# Altium project PCB_Project1.PrjPCB
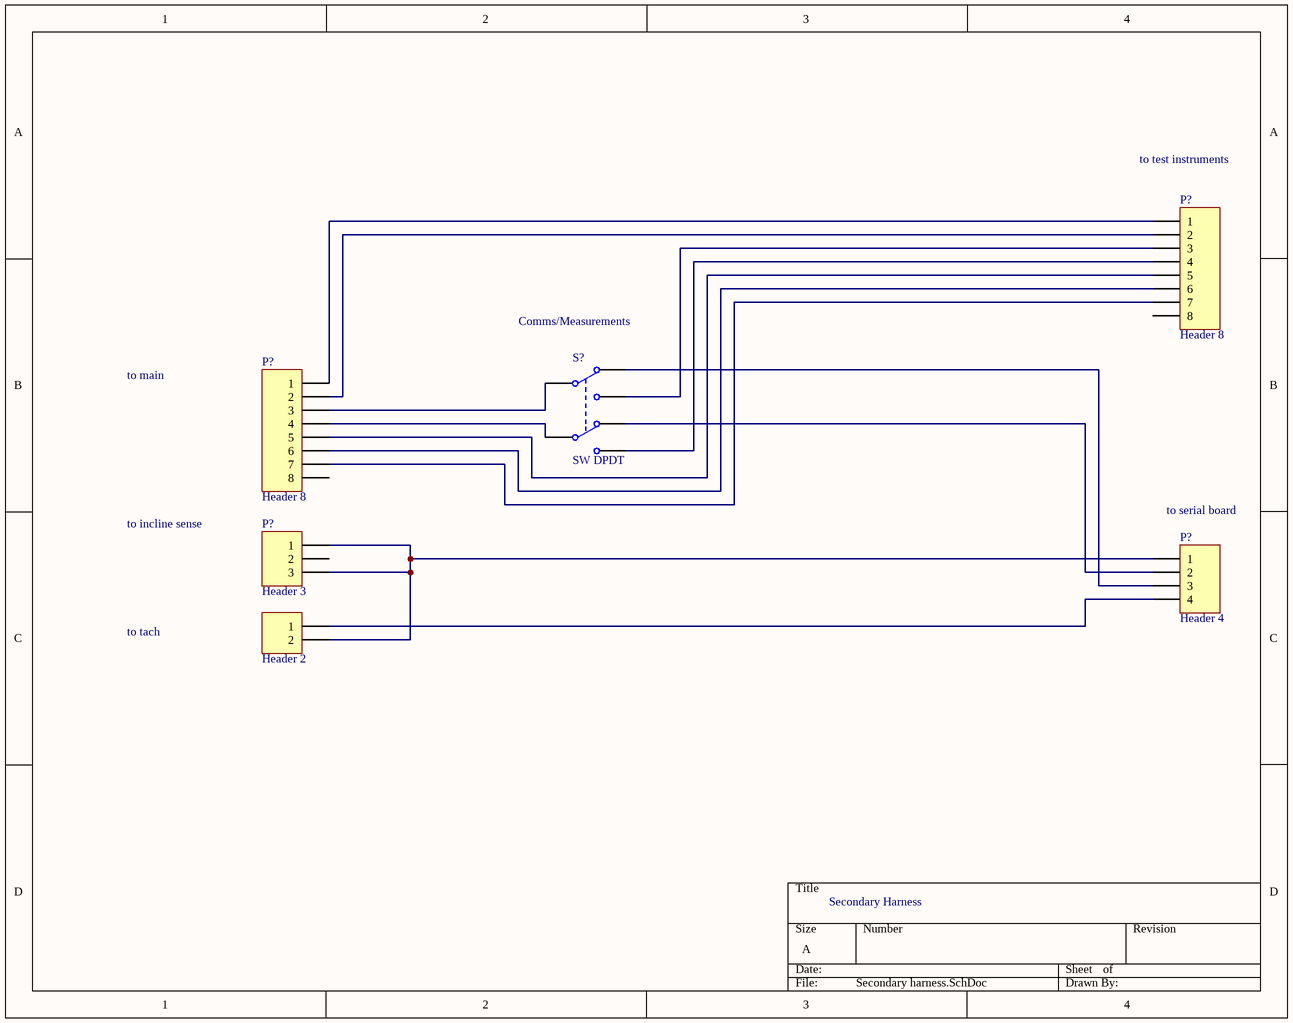
[diagram p0: Secondary harness.SchDoc]
3 sheets, 10 parts. Net scope: global (net labels, ports and power ports of the same name join across sheets).
Sheets:
  Secondary harness.SchDoc
  Incline harness.SchDoc
  Primary harness.SchDoc

## Sheet Secondary harness.SchDoc
size A

### Parts
(Parts that share a designator on the sheet are numbered #1, #2 ... from top to bottom, then left to right.)
?  Header 2  [HDR1X2]
P?#1  Header 8  [HDR1X8]
P?#2  Header 8  [HDR1X8]
P?#3  Header 3  [HDR1X3]
P?#4  Header 4  [HDR1X4]
S?  SW DPDT  [SOT23-6_N]

### Nets
Net?_1: ?.1 P?#4.4
Net?_2: ?.2 P?#3.1 P?#3.3 P?#4.1
NetP?#1_1: P?#1.1 P?#2.1
NetP?#1_2: P?#1.2 P?#2.2
NetP?#1_3: P?#1.3 S?.3(NO1)
NetP?#1_4: P?#1.4 S?.6(NO2)
NetP?#1_5: P?#1.5 P?#2.5
NetP?#1_6: P?#1.6 P?#2.6
NetP?#1_7: P?#1.7 P?#2.7
NetP?#2_3: P?#2.3 S?.1(COMMON1)
NetP?#2_4: P?#2.4 S?.5(COMMON2)
NetP?#4_2: P?#4.2 S?.4(NC2)
NetP?#4_3: P?#4.3 S?.2(NC1)

Not connected (* = marked no-connect by the designer): P?#1 8; P?#2 8; P?#3 2

### Notes on the sheet
- to test instruments
- (near S?) Comms/Measurements
- to main
- to incline sense
- (near P?#4) to serial board
- to tach
- Secondary Harness

### Library data of the parts
? = Header 2: Header, 2-Pin; LatestRevisionDate: 17-Jul-2002; LatestRevisionNote: Re-released for DXP Platform.; Publisher: Altium Limited
P?#1 P?#2 = Header 8: Header, 8-Pin; LatestRevisionDate: 17-Jul-2002; LatestRevisionNote: Re-released for DXP Platform.; Publisher: Altium Limited
P?#3 = Header 3: Header, 3-Pin; LatestRevisionDate: 17-Jul-2002; LatestRevisionNote: Re-released for DXP Platform.; Publisher: Altium Limited
P?#4 = Header 4: Header, 4-Pin; LatestRevisionDate: 17-Jul-2002; LatestRevisionNote: Re-released for DXP Platform.; Publisher: Altium Limited
S? = SW DPDT: Switch; Published: 24-Mar-1999; LatestRevisionDate: 29-May-2009; LatestRevisionNote: IPC-7351 Footprint Added.; PackageVersion: Mar-2001; PackageReference: SOT23-6; Publisher: Altium Limited; PackageDescription: 6-Pin SOT-23 Package 0.95 mm Pitch, 2.7 mm Lead Span; Code_JEITA: SC-74; Code_IPC: SOT26A-6

## Sheet Incline harness.SchDoc
size A
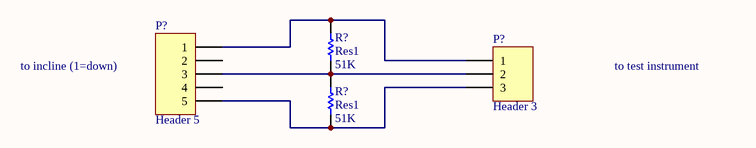
[diagram p1: Incline harness.SchDoc]

### Parts
(Parts that share a designator on the sheet are numbered #1, #2 ... from top to bottom, then left to right.)
P?#5  Header 5  [HDR1X5]
P?#6  Header 3  [HDR1X3]
R?#1  Res1  value 51K  [AXIAL-0.3]
R?#2  Res1  value 51K  [AXIAL-0.3]

### Nets
NetP?#5_1: P?#5.1 P?#6.1 R?#1.2
NetP?#5_3: P?#5.3 P?#6.2 R?#1.1 R?#2.1
NetP?#5_5: P?#5.5 P?#6.3 R?#2.2

Not connected (* = marked no-connect by the designer): P?#5 2 4

### Notes on the sheet
- to incline (1=down)
- to test instrument

### Library data of the parts
P?#5 = Header 5: Header, 5-Pin; LatestRevisionDate: 17-Jul-2002; LatestRevisionNote: Re-released for DXP Platform.; Publisher: Altium Limited
P?#6 = Header 3: Header, 3-Pin; LatestRevisionDate: 17-Jul-2002; LatestRevisionNote: Re-released for DXP Platform.; Publisher: Altium Limited
R?#1 R?#2 = Res1: Resistor; Published: 8-Jun-2000; LatestRevisionDate: 17-Jul-2002; LatestRevisionNote: Re-released for DXP Platform.; PackageReference: AXIAL-0.3; Publisher: Altium Limited; PackageDescription: Axial Device, Thru-Hole; 2 Leads; 0.3 in Pin Spacing

## Sheet Primary harness.SchDoc
size A